# Altium schematic sheet External Supply Interface.SchDoc
size A4; Organization: TESLA Motors, INC; Address1: 3500 Deer Creek Road; Address2: Palo Alto, CA; Address4: U.S.A.; SheetNumber: 12; SheetTotal: 13
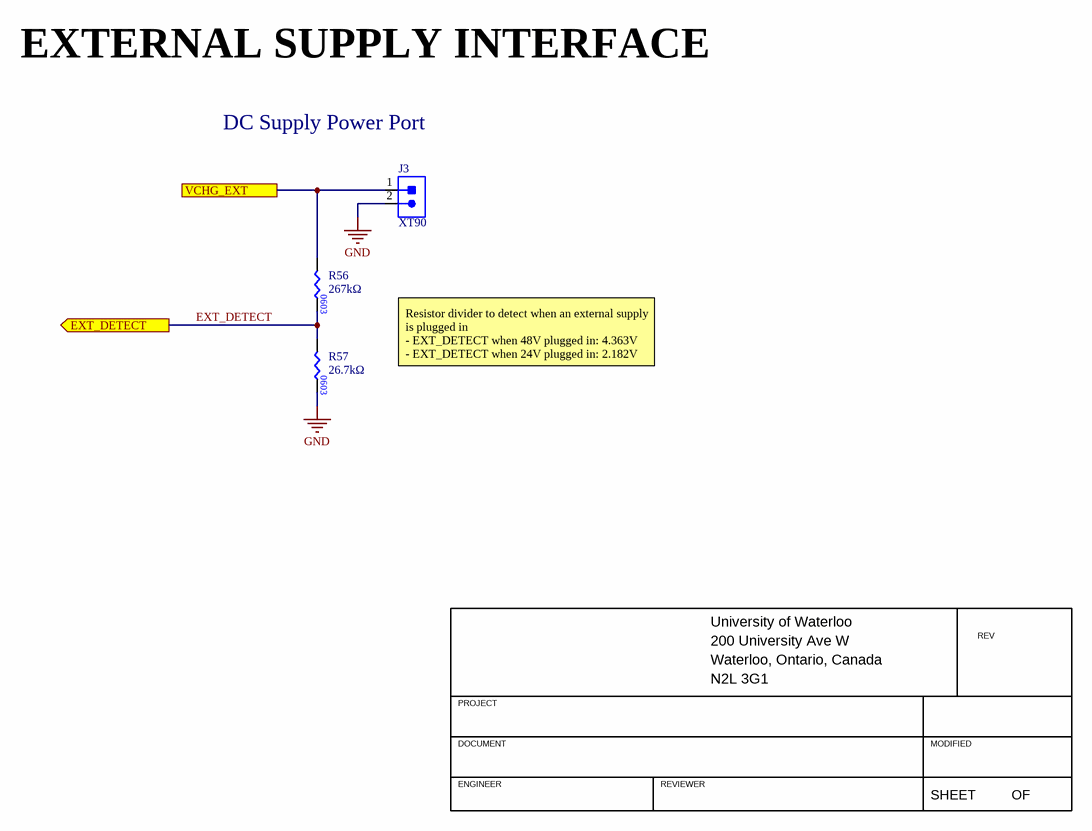
[diagram p0: External Supply Interface.SchDoc]

## Parts
J3  CON_2POS_XT90  [XT90]  (value not drawn)
R56  value 267kΩ  [RES0603]  (hidden comment: RES_267kΩ_0603_1%)
R57  value 26.7kΩ  [RES0603]  (hidden comment: RES_26.7kΩ_0603_1%)

## Ports
EXT_DETECT (out), VCHG_EXT

## Nets
GND: J3.2 R57.2
EXT_DETECT: R56.2 R57.1 ; port EXT_DETECT
VCHG_EXT: J3.1 R56.1 ; port VCHG_EXT

## Notes on the sheet
- EXTERNAL SUPPLY INTERFACE
- DC Supply Power Port
- Resistor divider to detect when an external supply is plugged in
  - EXT_DETECT when 48V plugged in: 4.363V
  - EXT_DETECT when 24V plugged in: 2.182V
- University of Waterloo
- 200 University Ave W
- REV
- PROJECT
- Waterloo, Ontario, Canada
- N2L 3G1
- DOCUMENT
- ENGINEER
- REVIEWER
- MODIFIED
- SHEET
- OF
- (in symbol RES_26.7kΩ_0603_1%) 0603

## Library data of the parts
J3 = CON_2POS_XT90: HIGH QUALITY GOLD PLATED XT90 MA; Manufacturer 1: DFRobot; Manufacturer Part Number 1: FIT0588; Mounting Type: TH; Package/Footprint: XT90; Supplier 1: Digi-Key; Supplier Part Number 1: 1738-1438-ND
R56 = RES_267kΩ_0603_1%: RES 267K OHM 1% 1/10W 0603; Manufacturer 1: Panasonic Electronic Components; Manufacturer Part Number 1: ERJ-3EKF2673V; Supplier 1: Digi-Key; Supplier Part Number 1: P267KHCT-ND; Package: 0603
R57 = RES_26.7kΩ_0603_1%: RES 26.7K OHM 1% 1/10W 0603; Manufacturer 1: Yageo; Manufacturer Part Number 1: RC0603FR-0726K7L; Supplier Part Number 1: 311-26.7KHRCT-ND; Supplier 1: Digi-Key